# Altium schematic sheet WS2812B Single Channel.SchDoc
size A4; DocumentNumber: 21; SheetNumber: ALT0056; SheetTotal: 21
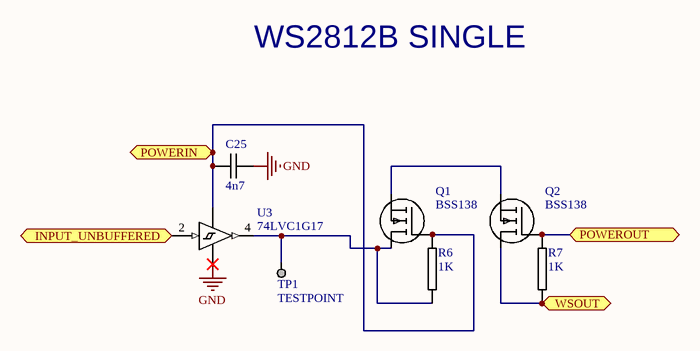
[diagram p0: WS2812B Single Channel.SchDoc]

## Parts
C25  4n7  [0603C-TBD]
Q1  BSS138  [SOT23-GDS]
Q2  BSS138  [SOT23-GDS]
R6  1K  [0603R-1k]
R7  1K  [0603R-1k]
TP1  TESTPOINT  [TESTPOINT]
U3  74LVC1G17  [SOT-353]

## Ports
INPUT_UNBUFFERED (in), POWERIN, POWEROUT, WSOUT

## Nets
GND: C25.2 U3.3(GND)
INPUT_UNBUFFERED: U3.2(A) ; port INPUT_UNBUFFERED
POWERIN: C25.1 Q1.G R6.1 U3.5(VCC) ; port POWERIN
POWEROUT: Q2.G R7.1 ; port POWEROUT
WSOUT: Q2.D R7.2 ; port WSOUT
NetQ1_D: Q1.D R6.2 TP1.1 U3.4(Y)
NetQ1_S: Q1.S Q2.S

## Notes on the sheet
- WS2812B SINGLE
- Title
- Size:
- Date:
- A4
- Number:
- Time:
- Revision:
- Sheet
- of
- File:

## Library data of the parts
C25 = 0603C-4N7: CAPACITOR 0603 CERAMIC; REEL: C83; Supplier 1: Digi-Key; Supplier Part Number 1: 445-5086-2-ND
Q1 Q2 = BSS138-SOT23: N CHANNEL MOSFET BSS138 SOT23; Manufacturer: Fairchild Semiconductor; Manufacturer Part Number: 2N7002; Drain to Source Voltage (Vdss): 60V; Vgs(th) (Max) @ Id: 2.5V @ 250µA; Power - Max: 200mW; Current - Continuous Drain (Id) @ 25° C: 115mA; Rds On (Max) @ Id, Vgs: 7.5 Ohm @ 500mA, 10V; FET Type: MOSFET N-Channel, Metal Oxide; FET Feature: Logic Level Gate; Input Capacitance (Ciss) @ Vds: 50pF @ 25V; Reel: Q2; Supplier 1: Digi-Key; Supplier Part Number 1: 2N7002NTR-ND; Package / Case: SOT-23-3, TO-236-3, Micro3™, SSD3, SST3; RoHS: RoHS Compliant; Mounting Type: Surface Mount; Packaging: Tape & Reel (TR); Gate Charge (Qg) @ Vgs: -; Supplier Part Number: 2N7002NTR-ND; Supplier: Digi-Key; Category: Discrete Semiconductor Products
R6 R7 = 0603R-1K: GENERIC RESISTOR 0603; Manufacturer Part Number: RMCF 1/16 1K 1% R; Manufacturer: Stackpole Electronics Inc; Reel: R14; Supplier 1: Digi-Key; Supplier Part Number 1: RMCF0603FT1K00TR-ND
TP1 = TESTPOINT: TESTPOINT SCOPE GRABBER; Manufacturer Part Number: 5010; Manufacturer: Keystone Electronics; Reel: TH; Supplier 1: Digi-Key; Supplier Part Number 1: 5010K-ND
U3 = 74LVC1G17: Single buffer